# EAGLE design si5351a (EAGLE 6.5.0)
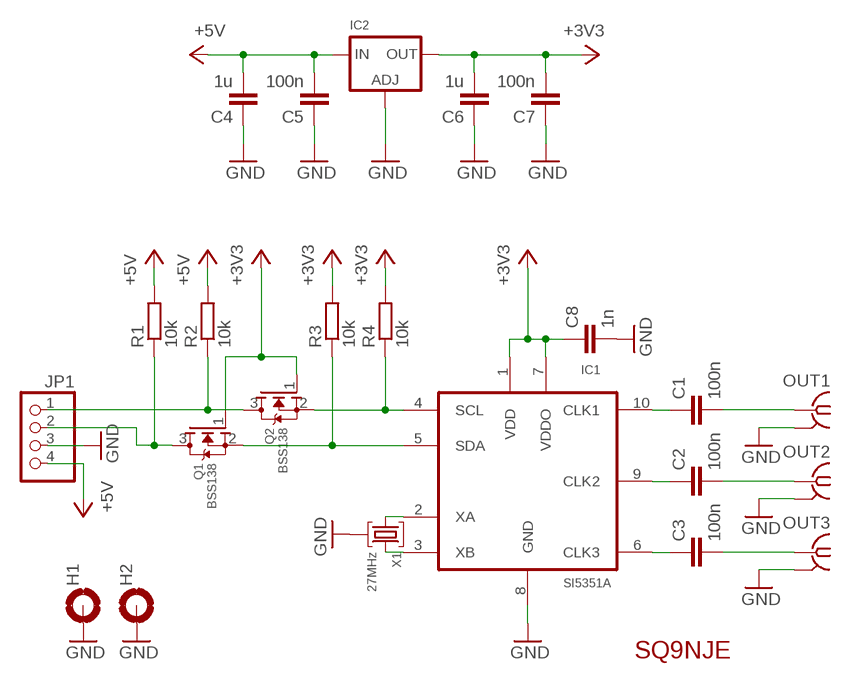
[diagram p0: schematic, sheet 1]

## Parts
C1  100n  C_0805  [0805]
C2  100n  C_0805  [0805]
C3  100n  C_0805  [0805]
C4  1u  C_0805  [0805]
C5  100n  C_0805  [0805]
C6  1u  C_0805  [0805]
C7  100n  C_0805  [0805]
C8  1n  C_0805  [0805]
H1  MOUNT-PAD-ROUND3.0  [3,0-PAD]
H2  MOUNT-PAD-ROUND3.0  [3,0-PAD]
IC1  SI5351A  [MSOP10]
IC2  LM1117SOT223-REFLOW  [SOT223-R]
JP1  PINHD-1X04_2.54-90°  [1X04/90]
OUT1  SMA-142-0711-821/826  [J502-ND-142-0711-821/826]
OUT2  SMA-142-0711-821/826  [J502-ND-142-0711-821/826]
OUT3  SMA-142-0711-821/826  [J502-ND-142-0711-821/826]
Q1  BSS138  MOSFET-NREFLOW  [SOT23-R]
Q2  BSS138  MOSFET-NREFLOW  [SOT23-R]
R1  10k  R_0805  [0805]
R2  10k  R_0805  [0805]
R3  10k  R_0805  [0805]
R4  10k  R_0805  [0805]
U$1  SQ9NJE  [SQ9NJE]
X1  27MHz  XTAL_TCX  [TXC]

## Nets
+3V3: C6.2 C7.2 C8.1 IC1.1(VDD) IC1.7(VDDO) IC2.2(OUT) Q1.1(G) Q2.1(G) R3.2 R4.2
+5V: C4.2 C5.2 IC2.3(IN) JP1.4 R1.2 R2.2
GND: C4.1 C5.1 C6.1 C7.1 C8.2 H1.B3,0(MOUNT) H2.B3,0(MOUNT) IC1.8(GND) IC2.1(ADJ) JP1.3 OUT1.G@1 OUT1.G@2 OUT1.G@3 OUT1.G@4 OUT2.G@1 OUT2.G@2 OUT2.G@3 OUT2.G@4 OUT3.G@1 OUT3.G@2 OUT3.G@3 OUT3.G@4 X1.2 X1.4
N$1: IC1.2(XA) X1.1
N$2: IC1.3(XB) X1.3
N$3: IC1.4(SCL) Q2.2(S) R4.1
N$4: IC1.5(SDA) Q1.2(S) R3.1
N$5: C1.1 IC1.10(CLK1)
N$6: JP1.1 Q2.3(D) R2.1
N$7: JP1.2 Q1.3(D) R1.1
N$8: C2.1 IC1.9(CLK2)
N$9: C3.1 IC1.6(CLK3)
N$11: C3.2 OUT3.1
N$12: C1.2 OUT1.1
N$13: C2.2 OUT2.1

## Library data of the parts
C1-C8 = zelazko:C: CAPACITOR
H1 H2 = holes:MOUNT-PAD-ROUND: MOUNTING PAD, round
IC1 = zelazko:SI5351
IC2 = microbuilder:LM1117: LM1117 Voltage Regulator LM1117 Adjustable Voltage regulator [Digikey: LM1117IMP-ADJDKR-ND] LM1117 3.3V Voltage regulator [AP1117E33GDIDKR-ND] LM1117 5.0V Voltage regulator [AP1117E50GDIDKR-ND] SOT223-REFLOW - SOT223 package for solder paste/reflow ovens SOT223-WAVE - SOT223 package for hand-soldering (larger pads) Note: For the fixed-voltage regulators, simply set the ADJ pin to GND.
JP1 = pinhead-2:PINHD-1X04: PIN HEADER
OUT1-OUT3 = con-coax:SMA-: SMA 50 Ohm End Launch Jack Receptacle - Round Contact Johnson Components Source: www.johnsoncomponents.com .. J502-ND.pdf; MF: JOHNSON COMPONENTS; MPN: 142-0711-821; OC_FARNELL: 1019328; OC_NEWARK: 16F3627
Q1 Q2 = microbuilder:MOSFET-N: N-Channel Mosfet LEGEND VDS: Voltage Drain-Source ID: Drain Current RDS(ON): Drain-Source On-State Resistance VGS(TH): Gate-Source Threshold Voltage CISS: Drain-Source Input Capacitance SOT-23 Name VDS ID RDS(ON) VGS(TH) CISS Order Number 2N7002E 60V 260mA 2.5 Ohm 2.5V @ 250uA 26.7pF @ 25V 2N7002ET1GOSTR-ND BSH103 30V 850mA 400 mOhm 400mV @ 1mA 83pF @ 24V BSH103,235-ND BSS138 60V 320mA 1.6 Ohm 1.5V @ 250uA 50pF @ 10V Mouser: 771-BSS138PW115 DMN2075U-7 20V 4.2A 38 mOhm 1V @ 250 uA 594.3pF @ 10V DMN2075U-7DICT-ND * BSS138 good choice for I2C level-shifting
R1-R4 = zelazko:R: RESISTOR
U$1 = zelazko:SQ9NJE
X1 = zelazko:XTAL_TCX

## Board
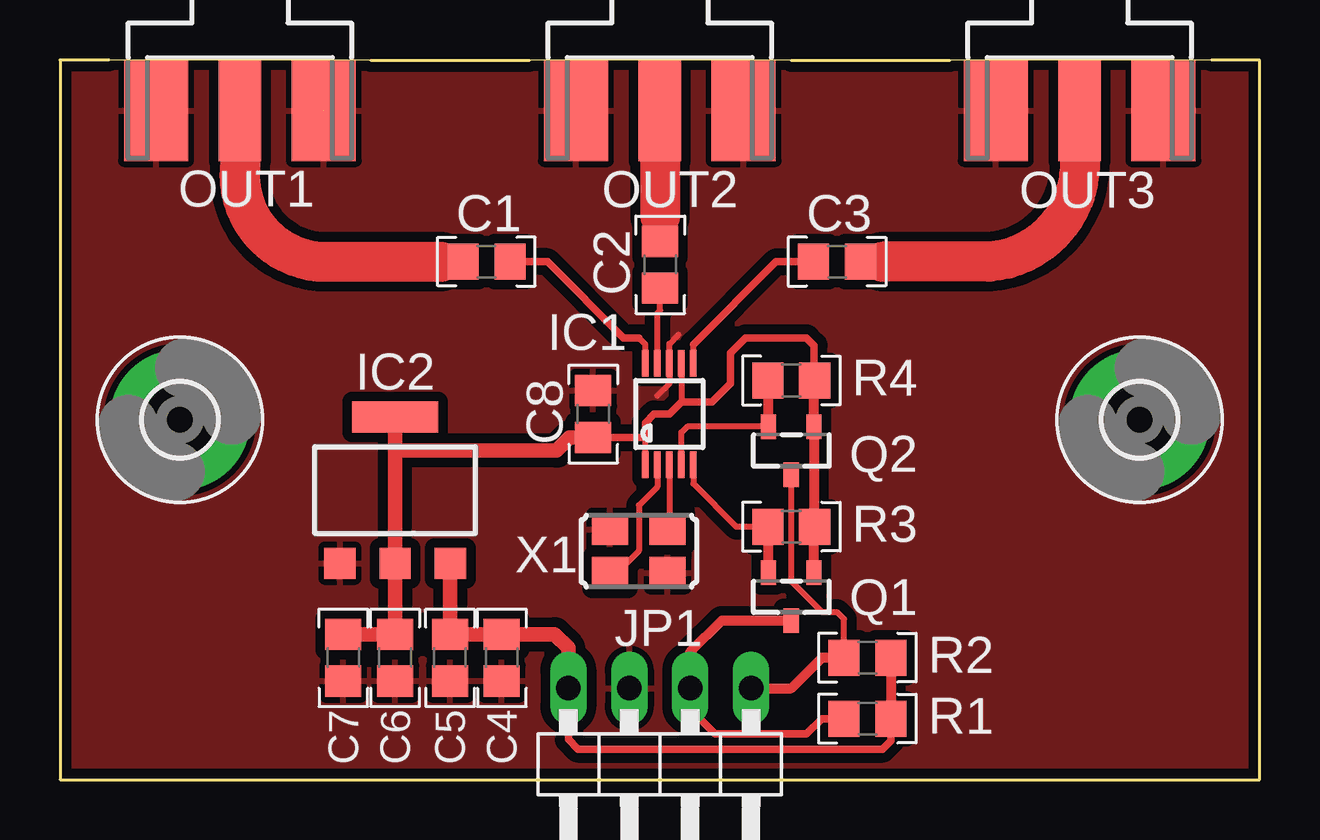
[diagram p1: board, top side]
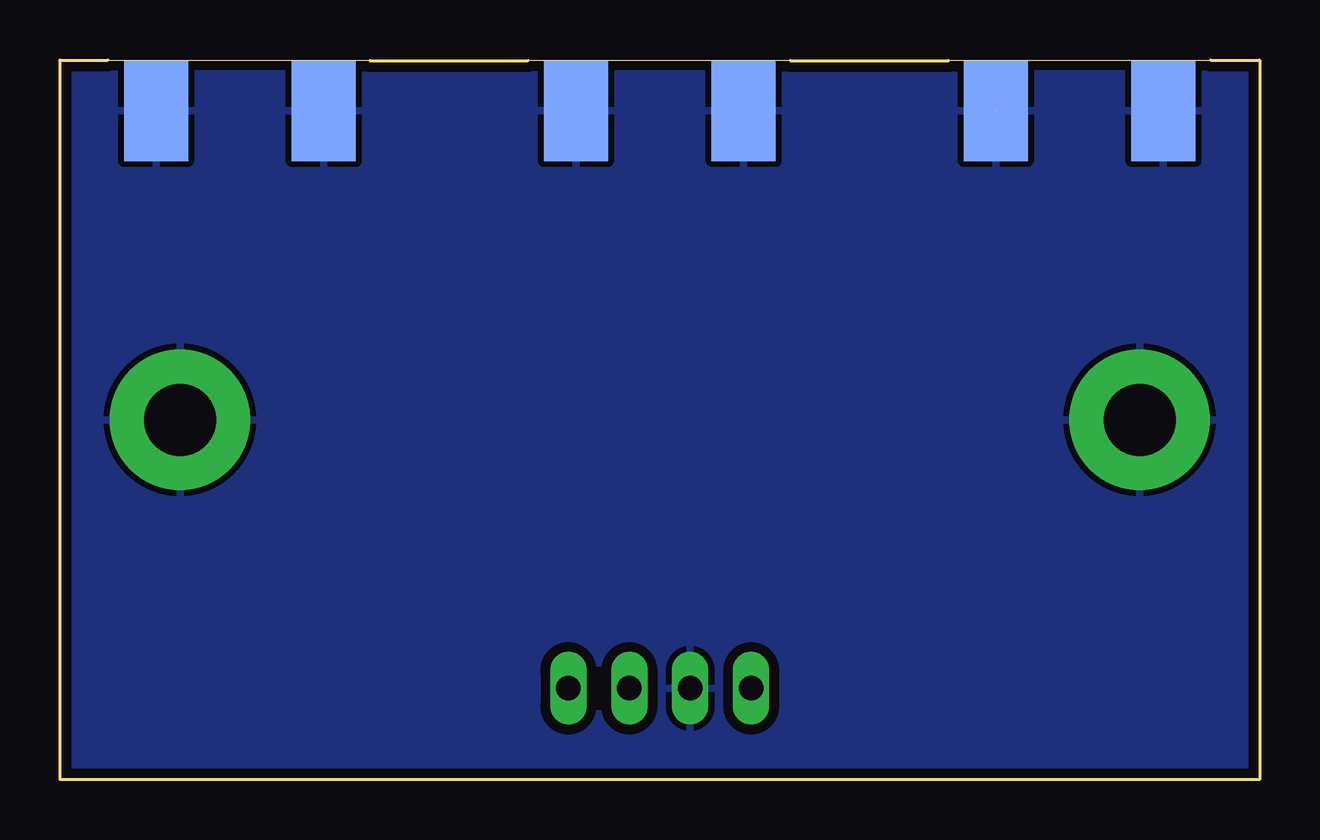
[diagram p2: board, bottom side, seen from below]

Size 50 x 30 mm. Coordinates in mm from the lower left corner, seen from the top.
Outline: 48.01,30 50,30 50,0 0,0 0,30 2.03,30
Outline: 37.08,29.97 30.48,29.97
Outline: 19.56,29.97 12.95,29.97
Copper layers (1*16): Top 0.035mm / dielectric 1.5mm / Bottom 0.035mm
Design rules "default *": minimum track width 10mil, minimum drill 24mil, track to track 8mil, track to pad 8mil, pad to pad 8mil, via to via 8mil, smd to smd 8mil, copper to edge 1mil, drill to drill 8mil, minimum pad ring 10mil, minimum via ring 8mil, stop-mask expansion 4mil, vias tented up to drill 0mil, thermal gap 10mil

### Footprints (pad centres in the part's own frame; a part is rotated, then mirrored left to right if it is on the bottom)
0805 = smd 1.3 x 1.5: 1 -0.975,0; 2 0.975,0
3,0-PAD = drill 3 pad 5.842: B3,0 0,0
MSOP10 = smd 0.27 x 1.1: 1 -1,-2.113; 2 -0.5,-2.113; 3 0,-2.113; 4 0.5,-2.113; 5 1,-2.113; 6 1,2.113; 7 0.5,2.113; 8 0,2.113; 9 -0.5,2.113; 10 -1,2.113
SOT223-R = smd 1.3 x 1.3: 1 -2.3,-3.05; 2 0,-3.05; 3 2.3,-3.05 | smd 3.6 x 1.3: 4 0,3.05
1X04/90 = drill 1.016 long: 1 -3.81,-3.81; 2 -1.27,-3.81; 3 1.27,-3.81; 4 3.81,-3.81
J502-ND-142-0711-821/826 = smd 4.191 x 1.778: 1 2.115,0 | smd 4.191 x 2.667: G@1 2.115,3.495; G@2 2.115,-3.495 | smd 4.191 x 2.667 bottom: G@3 2.115,3.495; G@4 2.115,-3.495
SOT23-R = smd 0.635 x 1.016: 1 -0.95,-1; 2 0.95,-1; 3 0,1
TXC = smd 1.5 x 1.3: 1 -1.2,-0.9; 2 1.2,-0.9; 3 1.2,0.9; 4 -1.2,0.9

### Placement (x,y rotation side)
C1  17.78,21.59 180 top
C2  25.02,21.46 90 top
C3  32.38,21.59 0 top
C4  18.41,5.08 90 top
C5  16.26,5.08 90 top
C6  13.97,5.08 90 top
C7  11.81,5.08 90 top
C8  22.23,15.24 90 top
H1  45,15 0 top
H2  5,15 0 top
IC1  25.4,15.24 0 top
IC2  13.97,12.06 0 top
JP1  25,0 180 top
OUT1  7.5,30 270 top
OUT2  25,30 270 top
OUT3  42.5,30 270 top
Q1  30.48,7.62 180 top
Q2  30.48,13.72 180 top
R1  33.66,2.54 0 top
R2  33.66,5.08 0 top
R3  30.48,10.54 0 top
R4  30.48,16.64 0 top
U$1  45.09,1.27 0 top
X1  24.13,9.53 0 top

### Tracks (layer width: path | path; a pad name or v marks a point on that pad's centre or on a via)
+3V3
  Top 0.254: IC1.7 25.9,15.74 | IC1.1 24.4,14.27
  Top 0.305: 31.43,16.61 31.43,18.1 31.11,18.41 28.57,18.41 27.94,17.78 27.94,16.51 27.17,15.74 25.9,15.74 25.4,15.24 24.77,15.24 24.4,14.88 24.4,14.27 C8.1
  Top 0.406: R4.2 31.43,16.61 Q2.1 31.43,10.57 R3.2 31.43,10.52 Q1.1
  Top 0.61: C7.2 C6.2 IC2.2 13.97,13.72 | 13.97,13.72 13.97,14.61 | C8.1 21.25,14.27 20.7,13.72 13.97,13.72
+5V
  Top 0.305: JP1.4 21.19,1.67 21.59,1.27 34.29,1.27 34.63,1.61 R1.2
  Top 0.406: R2.2 R1.2
  Top 0.61: IC2.3 C5.2 C4.2 20.61,6.05 21.19,5.48 JP1.4
GND  (1 unrouted)
  Top 0.254: 24.89,16 25.4,16.51 IC1.8 25.4,18.16 25.78,18.54
  pour Top (isolate 0.406): 0,0 50.16,0 50.16,29.84 50.16,30.48 0,30.48
  pour Bottom (isolate 0.406): 0,0 50.16,0 50.16,30.48 0,30.48 0,29.84
N$1
  Top 0.254: IC1.2 24.9,12.2 24.13,11.43 24.13,9.53 23.5,8.89 23.2,8.89 X1.1
N$2
  Top 0.254: IC1.3 25.4,10.55 X1.3
N$3
  Top 0.254: IC1.4 25.9,14.47 26.15,14.72 Q2.2
  Top 0.406: Q2.2 29.53,16.61 R4.1
N$4
  Top 0.254: IC1.5 26.4,12.34 28.19,10.54 R3.1
  Top 0.406: Q1.2 29.53,10.52 R3.1
N$5
  Top 0.254: IC1.10 24.4,18.14 24.13,18.41
  Top 0.305: 24.13,18.41 23.5,18.41 20.32,21.59 C1.1
N$6
  Top 0.254: Q2.3 30.48,8.26 31.75,6.99 32.38,6.99 32.68,6.69 R2.1
  Top 0.406: JP1.1 30.48,3.81 31.75,5.08 R2.1
N$7
  Top 0.305: R1.1 31.75,2.54 31.11,1.91 27.3,1.91 26.27,2.94 JP1.2
  Top 0.406: Q1.3 27.57,6.62 26.27,5.32 JP1.2
N$8
  Top 0.254: IC1.9 24.9,19.44 25.02,19.56 C2.1
N$9
  Top 0.254: IC1.6 26.4,18.14
  Top 0.305: 26.4,18.14 29.84,21.59 C3.1
N$11
  Top 1.27: 34.29,21.59 C3.2
  Top 1.676: OUT3.1 42.5,25.99 arc-90 38.73,21.59 34.29,21.59
N$12
  Top 1.27: 15.88,21.59 C1.2
  Top 1.676: OUT1.1 7.5,25.52 arc90 10.79,21.59 15.88,21.59
N$13
  Top 1.27: 25.02,23.5 C2.2
  Top 1.676: OUT2.1 25.02,23.5

### Text on the board
Document: +5V | GND | SDA | SCL